# EAGLE design buffer-simple (EAGLE 7.6.0)
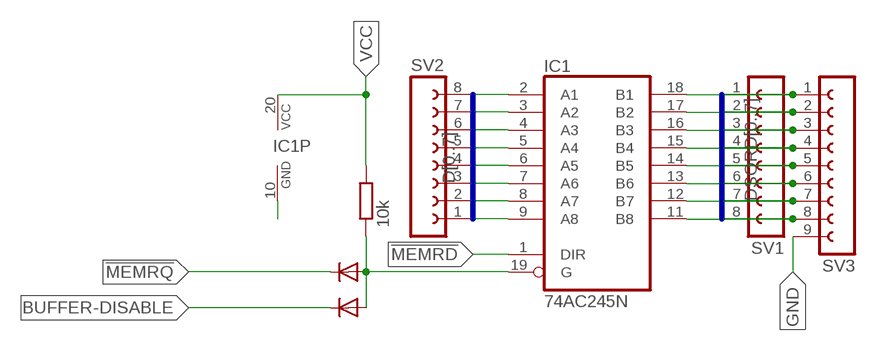
[diagram p0: schematic, sheet 1]

## Parts
D1  1N4148DO35-7  [DO35-7]
D2  1N4148DO35-7  [DO35-7]
IC1  74AC245N  [DIL20]
R1  10k  R-EU_0204/7  [0204/7]
SV1  FE08-1  [FE08]
SV2  FE08-1  [FE08]
SV3  FE09-1  [FE09]

## Nets
!MEMRD: IC1.1(DIR)
!MEMRQ: D1.C
BUFFER-DISABLE: D2.C
D0: IC1.2(A1) SV2.8
D1: IC1.3(A2) SV2.7
D2: IC1.4(A3) SV2.6
D3: IC1.5(A4) SV2.5
D4: IC1.6(A5) SV2.4
D5: IC1.7(A6) SV2.3
D6: IC1.8(A7) SV2.2
D7: IC1.9(A8) SV2.1
DSORD0: IC1.18(B1) SV1.1 SV3.1
DSORD1: IC1.17(B2) SV1.2 SV3.2
DSORD2: IC1.16(B3) SV1.3 SV3.3
DSORD3: IC1.15(B4) SV1.4 SV3.4
DSORD4: IC1.14(B5) SV1.5 SV3.5
DSORD5: IC1.13(B6) SV1.6 SV3.6
DSORD6: IC1.12(B7) SV1.7 SV3.7
DSORD7: IC1.11(B8) SV1.8 SV3.8
GND: IC1.10(GND) SV3.9
N$3: D1.A D2.A IC1.19(G) R1.1
VCC: IC1.20(VCC) R1.2

## Buses
D[0..7]
DSORD[0..7]

## Library data of the parts
D1 D2 = diode:1N4148: DIODE high speed (Philips)
IC1 = 74xx-eu:74*245: Octal BUS TRANSCEIVER, 3-state
R1 = rcl:R-EU_: RESISTOR, European symbol
SV1 SV2 = con-lsta:FE08-1: FEMALE HEADER; OC_FARNELL: unknown; OC_NEWARK: unknown
SV3 = con-lsta:FE09-1: FEMALE HEADER; OC_FARNELL: unknown; OC_NEWARK: unknown

## Board
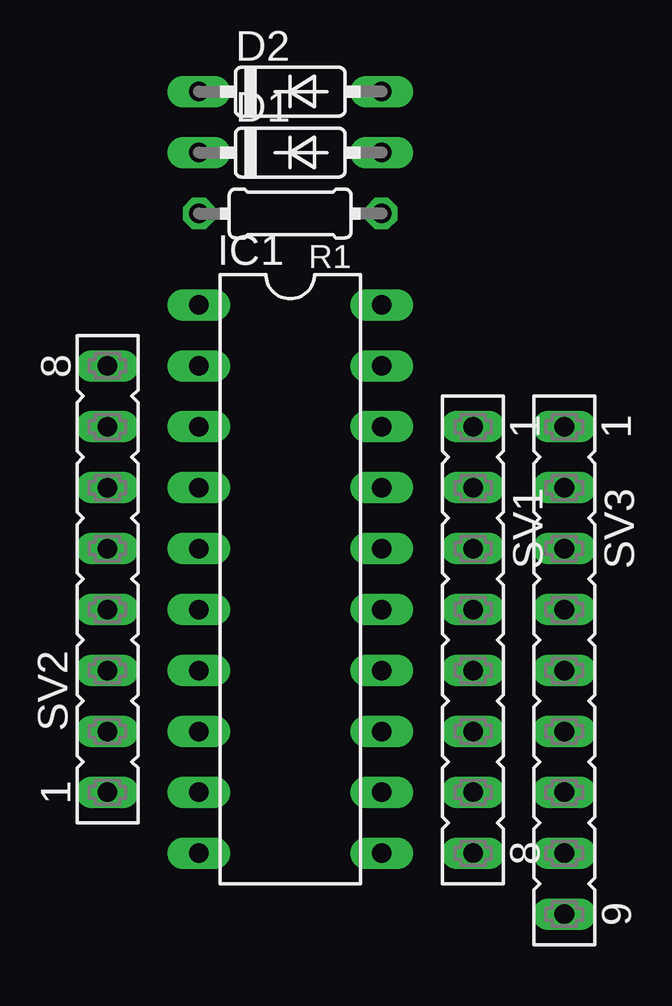
[diagram p1: board, top side]
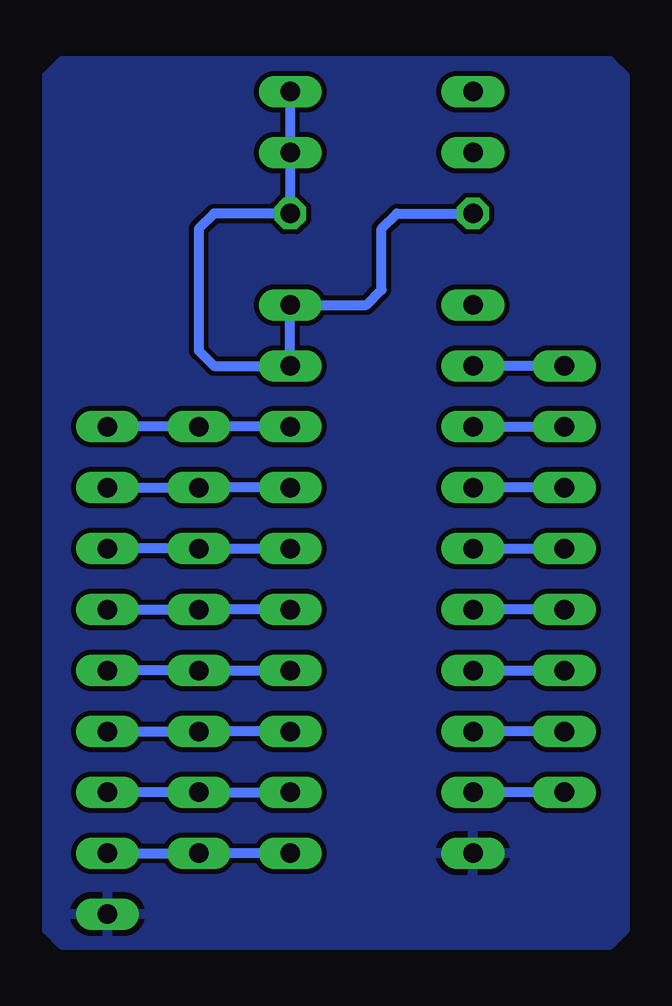
[diagram p2: board, bottom side, seen from below]

No outline drawn. Coordinates in mm, seen from the top.
Copper layers (1*16): Top 0.035mm / dielectric 1.5mm / Bottom 0.035mm
Design rules "default": minimum track width 10mil, minimum drill 24mil, track to track 8mil, track to pad 8mil, pad to pad 8mil, via to via 8mil, smd to smd 8mil, copper to edge 40mil, drill to drill 8mil, minimum pad ring 10mil, minimum via ring 8mil, stop-mask expansion 4mil, vias tented up to drill 0mil, thermal gap 10mil

### Footprints (pad centres in the part's own frame; a part is rotated, then mirrored left to right if it is on the bottom)
DO35-7 = drill 0.813 long: A 3.81,0; C -3.81,0
DIL20 = drill 0.813 long: 1 -11.43,-3.81; 2 -8.89,-3.81; 3 -6.35,-3.81; 4 -3.81,-3.81; 5 -1.27,-3.81; 6 1.27,-3.81; 7 3.81,-3.81; 8 6.35,-3.81; 9 8.89,-3.81; 10 11.43,-3.81; 11 11.43,3.81; 12 8.89,3.81; 13 6.35,3.81; 14 3.81,3.81; 15 1.27,3.81; 16 -1.27,3.81; 17 -3.81,3.81; 18 -6.35,3.81; 19 -8.89,3.81; 20 -11.43,3.81
0204/7 = drill 0.813 octagon: 1 -3.81,0; 2 3.81,0
FE08 = drill 0.813 long: 1 -8.89,0; 2 -6.35,0; 3 -3.81,0; 4 -1.27,0; 5 1.27,0; 6 3.81,0; 7 6.35,0; 8 8.89,0
FE09 = drill 0.813 long: 1 -10.16,0; 2 -7.62,0; 3 -5.08,0; 4 -2.54,0; 5 0,0; 6 2.54,0; 7 5.08,0; 8 7.62,0; 9 10.16,0

### Placement (x,y rotation side)
D1  1.27,11.43 0 top
D2  1.27,13.97 0 top
IC1  1.27,-6.35 270 top
R1  1.27,8.89 180 top
SV1  8.89,-8.89 270 top
SV2  -6.35,-6.35 90 top
SV3  12.7,-10.16 270 top

### Tracks (layer width: path | path; a pad name or v marks a point on that pad's centre or on a via)
D0
  Bottom 0.406: SV2.8 IC1.2
D1
  Bottom 0.406: IC1.3 SV2.7
D2
  Bottom 0.406: SV2.6 IC1.4
D3
  Bottom 0.406: IC1.5 SV2.5
D4
  Bottom 0.406: SV2.4 IC1.6
D5
  Bottom 0.406: IC1.7 SV2.3
D6
  Bottom 0.406: SV2.2 IC1.8
D7
  Bottom 0.406: SV2.1 IC1.9
DSORD0
  Bottom 0.406: IC1.18 SV1.1 SV3.1
DSORD1
  Bottom 0.406: IC1.17 SV1.2 SV3.2
DSORD2
  Bottom 0.406: IC1.16 SV1.3 SV3.3
DSORD3
  Bottom 0.406: IC1.15 SV1.4 SV3.4
DSORD4
  Bottom 0.406: IC1.14 SV1.5 SV3.5
DSORD5
  Bottom 0.406: IC1.13 SV1.6 SV3.6
DSORD6
  Bottom 0.406: IC1.12 SV1.7 SV3.7
DSORD7
  Bottom 0.406: IC1.11 SV1.8 SV3.8
GND
  pour Bottom: -8.89,-20.95 -8.89,14.61 -8.26,15.24 14.61,15.24 15.24,14.61 15.24,-20.95 14.61,-21.59 -8.26,-21.59
N$3
  Bottom 0.406: 5.08,5.08 IC1.19 8.26,2.54 8.89,3.17 8.89,8.26 8.26,8.89 R1.1 D1.A D2.A
VCC
  Bottom 0.406: IC1.20 1.91,5.08 1.27,5.71 1.27,8.26 0.64,8.89 R1.2